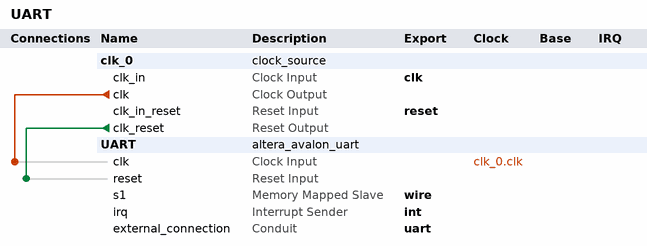
[diagram p0: system contents]
# Platform Designer (Qsys) system UART, Cyclone V 5CSEMA5F31C6
# Parameters at their usual value, and those the tool derives, are not listed.
package require -exact qsys 18.1
create_system UART
set_project_property DEVICE_FAMILY {Cyclone V}
set_project_property DEVICE 5CSEMA5F31C6

add_instance clk_0 clock_source 18.1
set_instance_parameter_value clk_0 clockFrequency 50000000

add_instance UART altera_avalon_uart 18.1
set_instance_parameter_value UART baud 9600
set_instance_parameter_value UART dataBits 8
set_instance_parameter_value UART fixedBaud true
set_instance_parameter_value UART parity EVEN
set_instance_parameter_value UART stopBits 1
set_instance_parameter_value UART useEopRegister true

# connections
add_connection clk_0.clk UART.clk clock
add_connection clk_0.clk_reset UART.reset reset

# exported interfaces
add_interface clk clock sink
set_interface_property clk EXPORT_OF clk_0.clk_in
add_interface int interrupt sender
set_interface_property int EXPORT_OF UART.irq
add_interface reset reset sink
set_interface_property reset EXPORT_OF clk_0.clk_in_reset
add_interface uart conduit end
set_interface_property uart EXPORT_OF UART.external_connection
add_interface wire avalon slave
set_interface_property wire EXPORT_OF UART.s1

set_interconnect_requirement {$system} qsys_mm.clockCrossingAdapter HANDSHAKE
set_interconnect_requirement {$system} qsys_mm.enableEccProtection FALSE
set_interconnect_requirement {$system} qsys_mm.insertDefaultSlave FALSE
set_interconnect_requirement {$system} qsys_mm.maxAdditionalLatency 1

save_system UART.qsys
